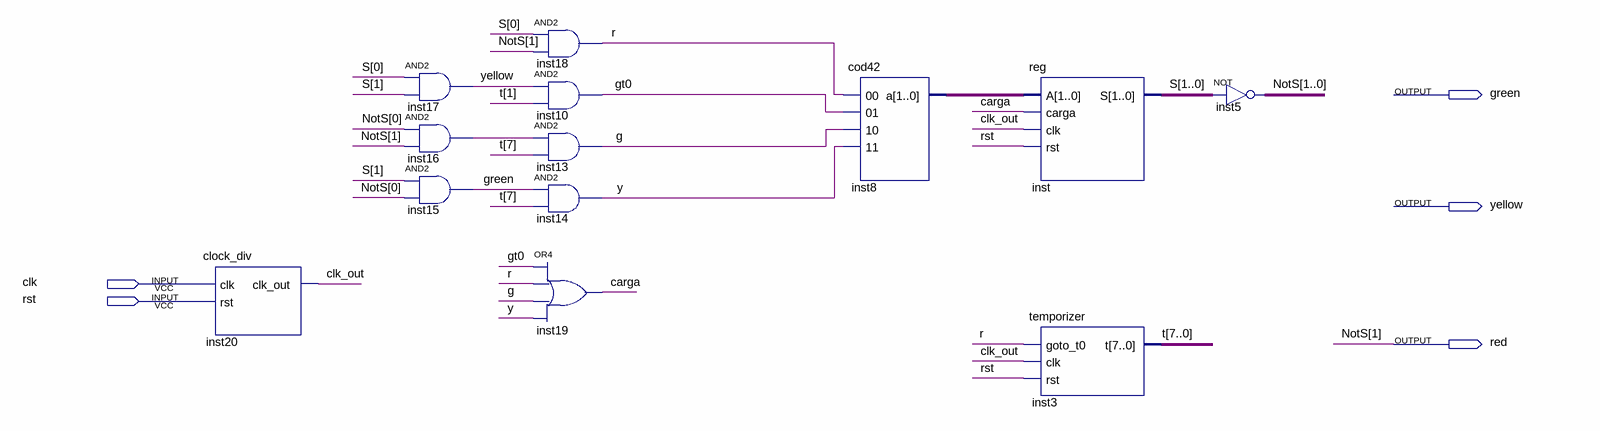
[diagram p0: schematic sheet]
// Quartus schematic fsm.bdf as structural Verilog: 13 symbols, 5 pins
module fsm (
  input  clk,
  input  rst,
  output green,
  output yellow,
  output red
);

  wire carga, clk_out, g, gt0, inst16_out, r, y;
  wire [0:0] NotS;
  wire [1:0] inst8_a, S;
  wire [7:0] t;

  clock_div inst20 (.clk(clk), .rst(rst), .clk_out(clk_out));
  and inst17 (yellow, S[0], S[1]);
  and inst16 (inst16_out, NotS[0], red);
  and inst15 (green, S[1], NotS[0]);
  and inst18 (r, S[0], red);
  and inst10 (gt0, yellow, t[1]);
  and inst13 (g, inst16_out, t[7]);
  and inst14 (y, green, t[7]);
  or inst19 (carga, gt0, r, g, y);
  cod42 inst8 (.\00 (r), .\01 (gt0), .\10 (g), .\11 (y), .a(inst8_a));
  \reg  inst (.A(inst8_a), .carga(carga), .clk(clk_out), .rst(rst), .S(S));
  temporizer inst3 (.goto_t0(r), .clk(clk_out), .rst(rst), .t(t));
  assign {red, NotS[0]} = ~S;  // NOT inst5, 2 bits wide

  // Other names for the same wires on the sheet: NotS[1] = red
endmodule
